# EasyEDA Pro project ProProject_hsr_pass_lite_2024-01-15.epro, board PCB_hsr_pass_lite_v1p1
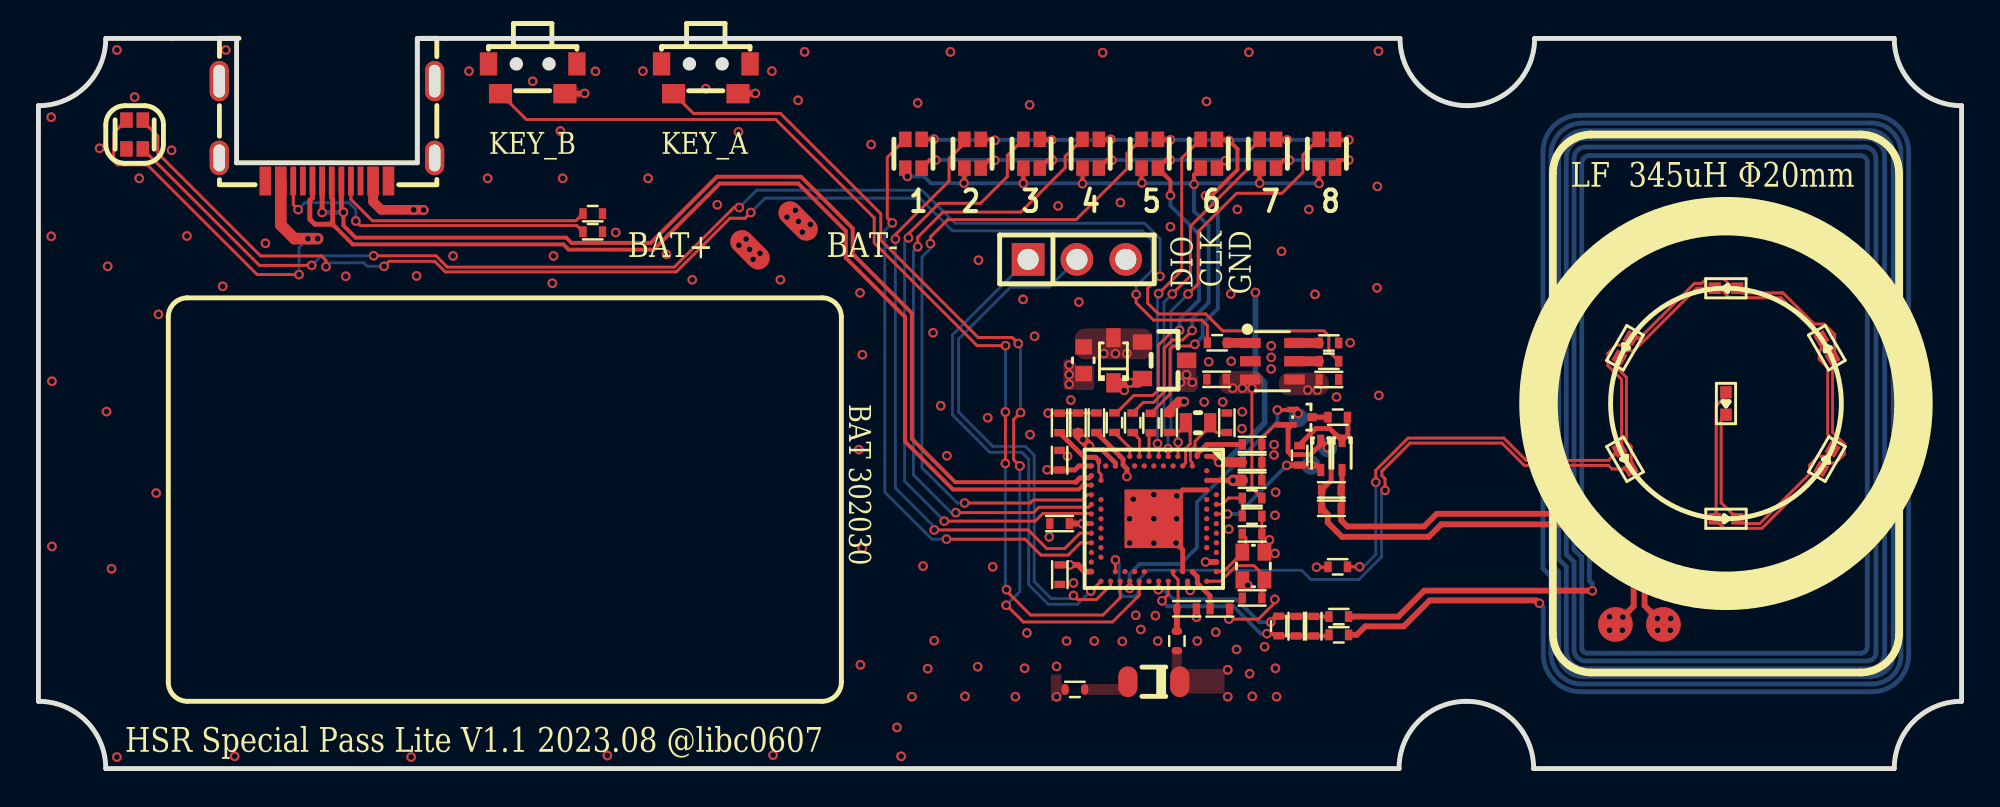
[diagram p1: board, top side]
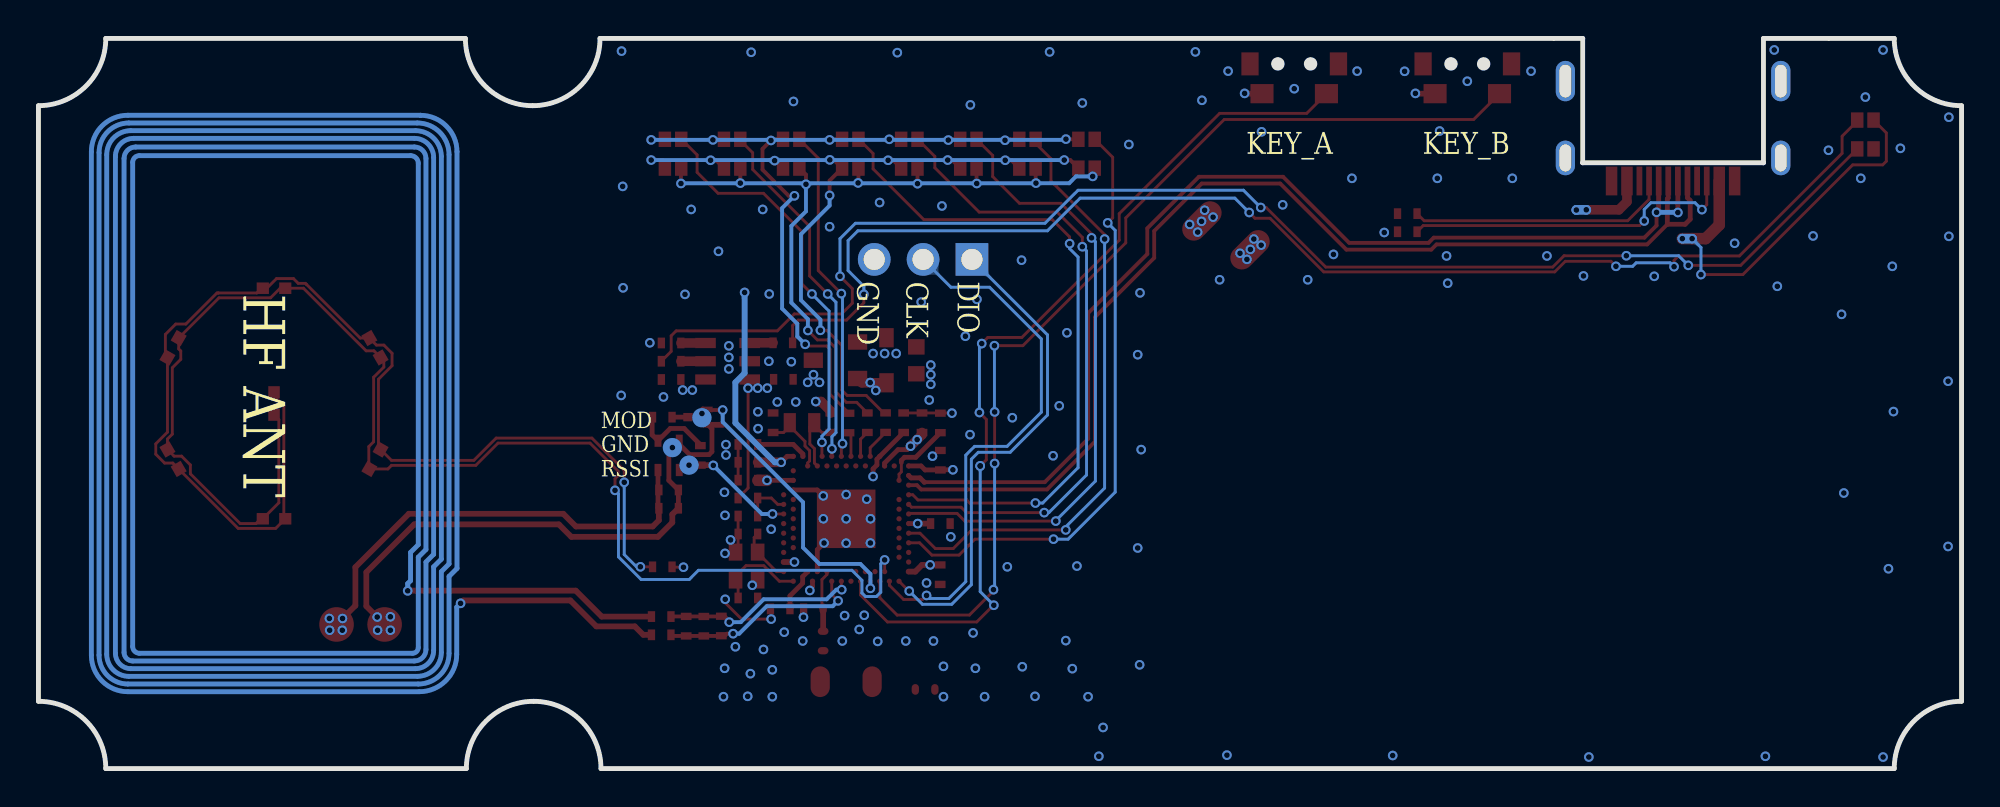
[diagram p2: board, bottom side, seen from below]

Outline 100 x 38 mm; copper layers: Top Layer, Inner1, Inner2, Bottom Layer. Coordinates in mm from the lower left corner of the outline.
Outline path: 0,3.5 0,34.5 arc(2.47,35.53) 3.5,38 10.3,38 10.3,31.53 19.7,31.53 19.7,38 70.8,38 arc(71.83,35.53) 74.3,34.5 arc(76.77,35.53) 77.8,38 96.5,38 arc(97.53,35.53) 100,34.5 100,3.5 arc(97.53,2.47) 96.5,0 77.75,0 arc(76.72,2.47) 74.25,3.5 arc(71.78,2.47) 70.75,0 3.5,0 arc(2.47,2.47) 0,3.5
Stack: Top Layer 0.035mm 外层铜厚1oz / Dielectric1 0.48mm 7628 RC49% 8.6mil / Inner1 0.035mm 内层铜厚 / Dielectric2 0.48mm 1.1mm H/HOZ 含铜 / Inner2 0.035mm 内层铜厚 / Dielectric3 0.48mm 7628 RC49% 8.6mil / Bottom Layer 0.035mm 外层铜厚1oz

## Design rules (mm)
net D-: DP1
net D+: DP1
template: 用户自定义配置
spacing Default (default): track to track 0.102, other pairs 0 to 0.102
track width Default (default): min 0.15, default 0.15, max 25.4
differential pair differentialPair (default): width min 0.127, default 0.254, max 2.54; gap min 0.152, default 0.152
via Default (default): diameter min 0.5, default 0.5, max 100.025; hole min 0.3, default 0.3, max 59.995
net GND uses copperRegion1
net VCC5V uses copperRegion1

## Placement (name value [footprint] x y rotation side)
ANT1  CA-C01  [ant-smd_l3.2-w1.6_ca-c01]  58 4.52 180 top
C1  1uF  [c0402]  63.11 15.01 180 top
C2  4.7uF  [c0402]  54.06 18 90 top
C5  100pF  [c0402]  65.4 7.41 90 top
C6  12pF  [c0402]  66.32 7.41 270 top
C8  100nF  [c0402]  63.11 16.87 0 top
C9  4.7uF  [c0402]  63.11 15.94 0 top
C11  12pF  [c0402]  63.11 12.21 0 top
C16  6pF  [c0402]  61.8 18 90 top
C17  12pF  [c0402]  63.11 8.88 180 top
C19  100nF  [c0402]  61.43 8.31 0 top
C20  6pF  [c0402]  58.8 18 90 top
C21  0.8pF  [c0402#2]  59.7 8.32 180 top
C25  4.7uF  [c0402]  55.01 18 90 top
C26  4.7uF  [c0402]  53.1 17.99 90 top
C27  100nF  [c0402]  53.11 10.09 270 top
C31  4.7uF  [c0402]  53.1 16.05 90 top
C33  1nF  [c0402]  67.23 13.55 0 top
C34  3.3nF  [c0402]  67.23 14.5 0 top
C39  100nF  [c0402]  53.1 12.75 180 top
C49  1uF  [c0402]  61.26 20.26 0 top
C50  4.7uF  [c0402]  67.1 20.25 0 top
D1  1N5819WS  [SOD-323_L1.8-W1.3-LS2.5-RD]  55.9 21.25 90 top
H1  PZ254V-11-03P  [HDR-TH_3P-P2.54-V-M]  54 26.5 0 top
IC6  nRF52840-QIAA  [aqfn50p700x700x85_hs-74n]  58 13 270 top
L5  3.9nH  [l0402]  59.2 6.64 270 top
L6  300R@100M  [l0603]  54.35 21.25 90 top
LED9  NCD0402W1  [LED0402-R-RD]  87.75 25 0 top
LED19  XL-1615RGBC-RF  [LED-ARRAY-SMD_4P-L1.6-W1.5-BR_XL-1615RGBC-RF]  5 33 90 top
LED20  XL-1615RGBC-RF  [LED-ARRAY-SMD_4P-L1.6-W1.5-BR_XL-1615RGBC-RF]  45.5 32 90 top
LED21  XL-1615RGBC-RF  [LED-ARRAY-SMD_4P-L1.6-W1.5-BR_XL-1615RGBC-RF]  48.57 32 90 top
LED22  XL-1615RGBC-RF  [LED-ARRAY-SMD_4P-L1.6-W1.5-BR_XL-1615RGBC-RF]  51.64 32 90 top
LED23  XL-1615RGBC-RF  [LED-ARRAY-SMD_4P-L1.6-W1.5-BR_XL-1615RGBC-RF]  54.71 32 90 top
LED24  XL-1615RGBC-RF  [LED-ARRAY-SMD_4P-L1.6-W1.5-BR_XL-1615RGBC-RF]  57.79 32 90 top
LED25  XL-1615RGBC-RF  [LED-ARRAY-SMD_4P-L1.6-W1.5-BR_XL-1615RGBC-RF]  60.86 32 90 top
LED26  XL-1615RGBC-RF  [LED-ARRAY-SMD_4P-L1.6-W1.5-BR_XL-1615RGBC-RF]  63.93 32 90 top
LED27  XL-1615RGBC-RF  [LED-ARRAY-SMD_4P-L1.6-W1.5-BR_XL-1615RGBC-RF]  67 32 90 top
LED28  NCD0402W1  [LED0402-R-RD]  87.75 13 180 top
LED29  NCD0402W1  [LED0402-R-RD]  93 16.1 240 top
LED30  NCD0402W1  [LED0402-R-RD]  93 21.9 300 top
LED31  NCD0402W1  [LED0402-R-RD]  82.5 21.9 60 top
LED32  NCD0402W1  [LED0402-R-RD]  82.5 16.1 120 top
LED33  NCD0402W1  [LED0402-R-RD]  87.75 19 90 top
NOREF  -  [Pad_e228]  84.5 7.5 180 top
NOREF#2  -  [Pad_e135]  67.04 16.7 0 top
NOREF#3  -  [Pad_e239]  82 7.5 180 top
NOREF#4  -  [Pad_e785]  39.5 28.5 135 top
NOREF#5  -  [Pad_e98]  65.5 18.26 0 top
NOREF#6  -  [Pad_e787]  37 27 135 top
NOREF#7  -  [Pad_e82]  66.17 15.79 0 top
Q3  -  [SOT-723_L1.2-W0.8-P0.40-LS1.2-BR]  65.69 18.29 180 top
Q5  AO3401A  [SOT-23_L2.9-W1.3-P1.90-LS2.4-BR]  58.56 21.25 180 top
R4  0Ω  [R0402]  67.62 7.91 180 top
R8  0Ω  [R0402]  67.62 6.96 180 top
R11  220Ω  [r0402]  67.56 18.29 0 top
R12  470kΩ  [r0402]  65.58 16.3 90 top
R19  1kΩ  [r0402]  57.85 17.98 270 top
R20  2kΩ  [r0402]  55.95 18 270 top
R21  1kΩ  [r0402]  56.9 18 270 top
R22  5.1kΩ  [r0402]  28.82 28.88 0 top
R23  5.1kΩ  [r0402]  28.82 27.94 0 top
R24  1kΩ  [r0402]  67.56 10.5 180 top
R25  2MΩ  [r0402]  63.11 14.08 0 top
R27  2MΩ  [r0402]  63.11 13.14 180 top
R28  NC  [R0402]  64.49 7.42 90 top
R29  5.1kΩ  [r0402]  67.1 22.15 180 top
R30  1kΩ  [r0402]  67.1 21.2 0 top
R31  1kΩ  [r0402]  61.29 22.16 0 top
R32  0  [r0402#2]  53.9 4.12 180 top
SW1  TS24CA  [SW-SMD_TS24CA]  25.7 35.9 0 top
SW2  TS24CA  [SW-SMD_TS24CA]  34.7 35.9 0 top
U4  TP4057-42-SOT26-R  [SOT-23-6_L2.9-W1.6-P0.95-LS2.8-BL]  64.16 21.2 270 top
USB1  TYPE-C 16P CB1.6  [USB-C-SMD_TYPE-C-16P-CB0.8-FIX]  15 33.18 180 top
VD1  -  [SOD-523_L1.2-W0.8-LS1.6-RD]  67.78 16.3 270 top
VD2  -  [SOD-523_L1.2-W0.8-LS1.6-RD]  66.68 16.3 270 top
X1  32MHz  [bt-xtal_2016]  63.18 10.54 90 top
X2  32.768kHz  [CRYSTAL-SMD_L1.7-W1.1]  60.3 18 0 top

## Footprints (pads in the part's own frame, mm; a bottom-side part is the same pattern mirrored in y, then rotated)
ant-smd_l3.2-w1.6_ca-c01
  rrect 1x1.6 smd: 1(-1.35,0) 2(1.35,0)
aqfn50p700x700x85_hs-74n
  rect 3.048x3.048 smd: 74(0,0)
  round 0.275 smd: A8(-1.25,3.25) A10(-0.75,3.25) A12(-0.25,3.25) A14(0.25,3.25) A16(0.75,3.25) A18(1.25,3.25) A20(1.75,3.25) A22(2.25,3.25) A23(2.75,3.25) AA24(3.25,-2.25) AB2(-2.75,-2.5) AC5(-2,-2.75) AC9(-1,-2.75) AC11(-0.5,-2.75) AC13(0,-2.75) AC15(0.5,-2.75) AC17(1,-2.75) AC19(1.5,-2.75) AC21(2,-2.75) AC24(3.25,-2.75) AD2(-2.75,-3.25) AD4(-2.25,-3.25) AD6(-1.75,-3.25) AD8(-1.25,-3.25) AD10(-0.75,-3.25) AD12(-0.25,-3.25) AD14(0.25,-3.25) AD16(0.75,-3.25) AD18(1.25,-3.25) AD20(1.75,-3.25) AD22(2.25,-3.25) AD23(2.75,-3.25) B1(-3.25,2.75) B3(-2.5,2.75) B5(-2,2.75) B7(-1.5,2.75) B9(-1,2.75) B11(-0.5,2.75) B13(0,2.75) B15(0.5,2.75) B17(1,2.75) B19(1.5,2.75) B24(3.25,2.75) C1(-3.25,2.25) D2(-2.75,2) D23(2.75,2) E24(3.25,1.75) F2(-2.75,1.5) F23(2.75,1.5) G1(-3.25,1.25) H2(-2.75,1) H23(2.75,1) J1(-3.25,0.75) J24(3.25,0.75) K2(-2.75,0.5) L1(-3.25,0.25) L24(3.25,0.25) M2(-2.75,0) N1(-3.25,-0.25) N24(3.25,-0.25) P2(-2.75,-0.5) P23(2.75,-0.5) R1(-3.25,-0.75) R24(3.25,-0.75) T2(-2.75,-1) T23(2.75,-1) U1(-3.25,-1.25) U24(3.25,-1.25) V23(2.75,-1.5) W1(-3.25,-1.75) W24(3.25,-1.75) Y2(-2.75,-2) Y23(2.75,-2)
bt-xtal_2016
  rect 0.889x0.711 smd: 1(-0.725,-0.575) 2(0.725,-0.575) 3(0.725,0.575) 4(-0.725,0.575)
c0402
  rect 0.381x0.559 smd: 1(-0.509,0) 2(0.507,0)
c0402#2
  rect 0.381x0.559 smd: 1(-0.509,0)
  rrect 0.381x0.559 smd: 2(0.507,0)
CRYSTAL-SMD_L1.7-W1.1
  rect 0.635x1 smd: 1(-0.635,0) 2(0.635,0)
HDR-TH_3P-P2.54-V-M
  rect 1.7x1.7 hole 1.1: 1(-2.54,0)
  round 1.7 hole 1.1: 2(0,0) 3(2.54,0)
l0402
  rrect 0.381x0.559 smd: 1(-0.509,0) 2(0.507,0)
l0603
  rect 0.8x0.864 smd: 1(-0.7,0) 2(0.7,0)
LED0402-R-RD
  rect 0.635x0.6 smd: 1(0.584,0) 2(-0.584,0)
LED-ARRAY-SMD_4P-L1.6-W1.5-BR_XL-1615RGBC-RF
  rect 0.8x0.65 smd: 1(0.75,-0.425) 2(0.75,0.425) 3(-0.75,0.425) 4(-0.75,-0.425)
Pad_e82
  round 1 smd far side: 8(0,0)
Pad_e98
  round 1 smd far side: 9(0,0)
Pad_e135
  round 1 smd far side: 10(0,0)
Pad_e228
  round 1.8 smd: 0(0,0)
Pad_e239
  round 1.8 smd: 0(0,0)
Pad_e785
  oval 2.4x1.2 smd: 7(0,0)
Pad_e787
  oval 2.4x1.2 smd: 7(0,0)
r0402
  rect 0.381x0.559 smd: 1(-0.508,0) 2(0.508,0)
r0402#2
  rrect 0.381x0.559 smd: 1(-0.508,0) 2(0.508,0)
R0402
  rect 0.381x0.559 smd: 1(-0.508,0) 2(0.508,0)
SOD-323_L1.8-W1.3-LS2.5-RD
  rect 1x0.75 smd: 1(-1.173,0) 2(1.173,0)
SOD-523_L1.2-W0.8-LS1.6-RD
  rect 0.635x0.36 smd: 1(-0.762,0) 2(0.762,0)
SOT-23-6_L2.9-W1.6-P0.95-LS2.8-BL
  rect 0.532x1.072 smd: 1(-0.95,-1.149) 2(0,-1.149) 3(0.95,-1.149) 4(0.95,1.149) 5(0,1.149) 6(-0.95,1.149)
SOT-23_L2.9-W1.3-P1.90-LS2.4-BR
  rect 1x0.8 smd: 1(1.15,-0.95) 2(1.15,0.95) 3(-1.15,0)
SOT-723_L1.2-W0.8-P0.40-LS1.2-BR
  rect 0.489x0.294 smd: 1(0.508,-0.4) 2(0.508,0.4)
  rect 0.489x0.434 smd: 3(-0.529,0)
SW-SMD_TS24CA
  rect 0.9x1.2 smd: 1(-2.3,0.775) 2(2.3,0.775)
  rect 1.2x1 smd: 3(-1.675,-0.775) 4(1.675,-0.775)
USB-C-SMD_TYPE-C-16P-CB0.8-FIX
  oval 1x1.8 hole 0.6x1.4: 0(-5.6,1.4) 2(5.6,1.4)
  oval 1x2.1 hole 0.6x1.7: 1(-5.6,-2.6) 3(5.6,-2.6)
  rect 0.6x1.5 smd: A1B12(-3.2,2.6) A4B9(-2.4,2.6) B1A12(3.2,2.6) B4A9(2.4,2.6)
  rect 0.3x1.5 smd: A5(-1.25,2.6) A6(-0.25,2.6) A7(0.25,2.6) A8(1.25,2.6) B5(1.75,2.6) B6(0.75,2.6) B7(-0.75,2.6) B8(-1.75,2.6)

## Nets
As in the schematic, except:
GND: ANT1.1 C1.1 C2.2 C8.2 C9.2 C11.2 C16.2 C17.2 C19.2 C20.2 C21.1 C25.2 C26.2 C27.2 C31.2 C33.1 C34.1 C39.2 C49.1 C50.2 H1.3 IC6.74 IC6.B7 IC6.F23 L5.2 NOREF#2.10 NOREF#3.0 NOREF#4.7 Q3.2 R22.2 R23.2 R27.1 R29.1 R32.2 SW1.1 SW1.2 SW2.1 SW2.2 U4.2 USB1.0 USB1.1 USB1.2 USB1.3 USB1.A1B12 USB1.B1A12 VD2.1 X1.2 X1.4
BAT: C49.2 NOREF#6.7 Q5.3 R25.2 U4.3
LF_MOD: IC6.U24 NOREF#5.9 Q3.1
LF_RSSI: IC6.A12 NOREF#7.8 R12.1 VD2.2
P_LF_ANT_RAW: C33.2 C34.2 NOREF.0 VD1.2

Pads without a net: IC6 A18 AB2 B3 N24; LED19 3; USB1 A8 B8

## Via types
v1: diameter 0.5, hole 0.3, Top Layer to Bottom Layer, 280 vias
v2: diameter 0.5, hole 0.299, Top Layer to Bottom Layer, 5 vias

## Routing (per net, layer and track width the routed paths; a pad name or vN(x,y) marks a point on that pad's centre or on a via; arc(x,y) is an arc through that point)
GND: length 48.4
  Top Layer w0.15: v1(64.29,8.81) 64.29,8.63 63.44,7.78 v1(61.9,7.78) ; C25.2 C2.2 52.51,18.51 v1(52.5,18.5) ; R27.1 C11.2 63.62,11.4 X1.2 ; C1.1 C9.2 63.62,17.12 63.58,17.16 64.31,17.89 64.4,17.89
  Top Layer w0.25: C33.1 C34.1 67.22,15 67.22,16.52 v1(67.04,16.7) VD2.1 66.68,16.88 66.14,16.34 65.13,16.34 64.98,16.49 64.98,17.68 Q3.2 ; IC6.B7 59.5,14.5 v1(59.19,14.19) v1(58,13) 58,12.89 v1(59.15,11.74) 59.5,11.39 IC6.F23
  Top Layer w0.3: C33.1 67.04,13.23 67.04,12.81 67.79,12.06 72.29,12.06 72.94,12.71 80.46,12.71 82.95,10.22 82.95,8.45 v1(82.39,7.89) NOREF#3.0 ; Q3.2 64.4,17.89
  Top Layer w0.5: v1(59.58,19.1) 59.3,19.1 58.8,18.6 C20.2
  vias: v1(0.66,33.9) v1(0.66,27.7) v1(0.7,20.16) v1(0.7,11.56) v1(3.18,32.28) v1(3.54,18.58) v1(3.6,26.14) v1(3.8,10.4) v1(4.08,37.4) v1(4.08,0.6) v1(5,34.95) v1(5.24,30.72) v1(6.12,14.34) v1(6.24,23.64) v1(6.92,32.18) v1(7.72,27.72) v1(9.58,25.1) v1(9.74,37.4) v1(10.2,0.64) v1(11.8,27.34) v1(15.98,25.62) v1(19.38,0.6) v1(19.66,25.64) v1(21.56,26.68) v1(22.39,36.3) v1(23.36,30.72) v1(25.7,35.77) v1(26.72,25.26) v1(26.78,26.68) v1(27.14,33.18) v1(27.26,30.72) v1(28.96,36.29) v1(29.58,0.68) v1(30.02,27.9) v1(31.43,36.3) v1(31.7,30.72) v1(32.66,26.76) v1(34,25.44) v1(34.7,35.38) v1(35.3,29.34) v1(36.4,33.14) v1(38.14,36.3) v1(38.2,0.7) v1(38.58,25.44) v1(38.92,28.7) v1(39.36,29.06) v1(39.5,34.78) v1(39.52,28.48) v1(39.72,27.92) v1(39.84,37.3) v1(40.14,28.32) v1(42.72,24.76) v1(42.66,16.6) v1(42.74,5.4) v1(42.84,21.54) v1(42.84,11.48) v1(43.3,32.48) v1(44.64,2.14) v1(44.86,0.64) v1(45.42,3.74) v1(45.72,34.64) v1(46,10.54) v1(46.24,5.2) v1(46.52,22.68) v1(46.58,6.66) v1(46.92,18.88) v1(47.24,16.28) v1(47.42,37.3) v1(48.18,3.76) v1(48.84,5.3) v1(48.88,26.46) v1(49.36,18.26) v1(49.62,10.5) v1(50.8,3.74) v1(51.2,24.42) v1(51.28,5.22) v1(51.4,7.06) v1(51.54,34.54) v1(51.56,17.38) v1(51.8,22.5) v1(52.56,12.06) v1(52.94,5.32) v1(52.94,3.74) v1(53.02,29.28) v1(53.51,16.26) v1(53.46,6.64) v1(53.68,19.18) v1(53.82,9.66) v1(54.1,24.28) v1(54.9,6.64) v1(55.34,37.26) v1(56.26,29.46) v1(56.36,6.62) v1(56.74,13) v1(56.74,11.74) v1(56.93,14.02) v1(57.06,7.98) v1(57.32,7.24) v1(58,14.26) v1(58,11.73) v1(58.08,7.96) v1(58.2,6.64) v1(58.86,28.2) v1(59.19,13) v1(60.22,7.88) v1(60.26,6.64) v1(60.62,19.08) v1(60.74,34.72) v1(60.85,21.17) v1(61.22,7.1) v1(61.58,19.08) v1(61.84,5.14) v1(61.84,3.74) v1(61.9,12.46) v1(62,24.7) v1(62.02,21.2) v1(62.34,29.1) v1(62.3,6.2) v1(62.59,18.57) v1(62.58,17.69) v1(62.94,37.28) v1(62.88,9.54) v1(62.98,4.94) v1(63.12,3.76) v1(63.76,6.34) v1(64.01,11.9) v1(64.1,22) v1(64.1,21.4) v1(64.1,20.8) v1(64.25,16.86) v1(64.25,16.32) v1(64.33,14.38) v1(64.3,13.18) v1(64.3,11.2) v1(64.32,5.22) v1(64.38,3.74) v1(64.64,26.92) v1(66.06,29.1) v1(66.38,24.68) v1(67.5,19.34) v1(68.21,22.16) v1(69.62,30.3) v1(69.6,25.02) v1(69.68,37.34) v1(69.7,19.42) v1(81.7,7.9) v1(81.7,7.2) v1(82.37,7.2)
GNDHF: length 552.3
  Top Layer w0.3: v1(78.05,8.6) 77.9,8.75 72.34,8.75 70.99,7.4 68.99,7.4 68.55,6.96 R8.1 ; R4.1 70.71,7.91 72.06,9.26 80.79,9.26 v1(80.8,9.25)
  Bottom Layer w0.25: v1(78.05,8.6) 78.25,8.4 78.25,5.95 arc(78.82,4.57) 80.2,4 95.35,4 arc(96.69,4.56) 97.25,5.9 97.25,32.1 ; v1(80.8,9.25) 80.8,9.63 80.65,9.78 80.65,11.25 80.25,11.65 80.25,31.5 arc(80.37,31.78) 80.65,31.9 94.75,31.9 arc(95,31.8) 95.1,31.55 95.1,6.35 arc(95,6.1) 94.75,6 80.55,6 arc(80.34,6.09) 80.25,6.3 80.25,11 79.85,11.4 79.85,31.75 arc(80.03,32.17) 80.45,32.35 94.95,32.35 arc(95.37,32.17) 95.55,31.75 95.55,6.05 arc(95.42,5.73) 95.1,5.6 80.45,5.6 arc(80.03,5.78) 79.85,6.2 79.85,10.75 79.45,11.15 79.45,31.8 arc(79.74,32.51) 80.45,32.8 95.05,32.8 arc(95.72,32.52) 96,31.85 96,6 arc(95.77,5.43) 95.2,5.2 80.4,5.2 arc(79.73,5.48) 79.45,6.15 79.45,10.5 79.05,10.9 79.05,31.85 arc(79.45,32.8) 80.4,33.2 95.2,33.2 arc(96.08,32.83) 96.45,31.95 96.45,5.95 arc(96.11,5.14) 95.3,4.8 80.3,4.8 arc(79.42,5.17) 79.05,6.05 79.05,10.25 78.65,10.65 78.65,31.95 arc(79.13,33.12) 80.3,33.6 95.3,33.6 arc(96.4,33.15) 96.85,32.05 96.85,5.9 arc(96.41,4.84) 95.35,4.4 80.25,4.4 arc(79.12,4.87) 78.65,6 78.65,10 78.24,10.41 78.24,32.1 arc(78.79,33.44) 80.14,34 80.14,34 95.35,34 arc(96.7,33.44) 97.25,32.1
VCC3.3V: length 89.8
  Top Layer w0.15: v1(66.46,10.48) 67.03,10.48 R24.2
  Top Layer w0.25: IC6.AD14 v1(54.28,12.75) ; IC6.B1 61.07,16.25 v1(61.38,15.94) ; C25.1 IC6.W1 56.4,16.1 56.4,15.8 56.6,15.6 v1(56.6,15.2)
  Top Layer w0.3: v1(37.28,35.14) 37.26,35.12 SW2.4 ; IC6.AD23 54.4,10.25 54.05,10.6 v1(53.63,10.6) C27.1 ; v1(60.69,10.75) IC6.A22 ; v1(28.4,35.14) 28.38,35.12 SW1.4 ; v1(54.28,12.75) C39.1
  Top Layer w0.5: v1(61.38,15.94) C9.1
  Inner2 w0.4: v1(61.38,15.94) 62.4,15.94 63.24,15.1 63.24,13.13 63.87,12.5 64.5,12.5 66.46,10.54 v1(66.46,10.48)
  Inner2 w0.6: v1(28.4,35.14) 29.26,34.28 36.42,34.28 v1(37.28,35.14) 38.7,33.72 62.2,33.72 62.62,33.3 62.62,29.98 63.28,29.32 v1(63.28,24.78)
  Inner2 w0.8: 59.96,15.2 59.96,11.48 v1(60.69,10.75) ; 59.96,15.2 56.9,15.2 54.45,12.75 v1(54.28,12.75) 53.63,12.1 v1(53.63,10.6) ; 59.96,15.2 60.64,15.2 v1(61.38,15.94)
  Bottom Layer w0.3: v1(61.38,15.94) 61.71,15.94 63.76,17.99 63.76,20.1 63.28,20.58 v1(63.28,24.78)
VCC5V: length 27
  Top Layer w0.25: v1(52.45,15.55) 53.09,15.55 C31.1 53.9,15.54 54.1,15.75 IC6.AD2
  Inner2 w0.4: v1(52.45,15.55) 52.45,16.95 55.99,20.49 55.99,21.01 v1(55.4,21.6)
  Inner2 w1: v1(66.5,19.7) v1(66,19.7) 66,22.8 65.1,23.7 56.8,23.7 56,22.9 v1(56,21.6) ; v1(56,21.6) v1(55.4,21.6) ; v1(56,21.6) v1(56.6,21.6)
BAT: length 43.8
  Top Layer w0.15: v1(63.1,19.8) 63.1,14.6 R25.2
  Inner2 w1: 36.66,27.34 v1(36.98,27.02) 37.3,26.7 43.22,26.7 45,24.92 45,22 48.2,18.8 48.2,16.59 50.29,14.5 54.51,14.5 55.9,15.89 55.9,17.3 58.7,20.1 v1(59.39,20.1) v1(60,20.1) 63.1,20.1
  vias: v1(36.42,27.24) v1(36.8,27.56) v1(37.16,26.5) v1(37.52,26.82) v1(59.7,20.5) v1(62.1,19.8) v1(62.6,19.8)
CC1: length 13.6
  Top Layer w0.15: USB1.A5 16.25,29.62 17.36,28.51 27.94,28.51 R22.1
CC2: length 17.5
  Top Layer w0.15: USB1.B5 13.25,29.34 v1(13.5,29.09) ; v1(16.5,28.5) 16.74,28.26 27.99,28.26 R23.1
  Bottom Layer w0.15: v1(16.5,28.5) 16.5,29.1 16.15,29.45 13.86,29.45 v1(13.5,29.09)
CHRG: length 1.2
  Top Layer w0.5: 63.01,22.15 63,22.16 R31.2
D+: length 58.3
  Top Layer w0.2: 15.3,28.33 16.34,27.28 27.3,27.28 27.57,27.01 31.99,27.01 35.43,30.45 39.51,30.45 41.98,27.98 41.98,26.58 45.06,23.5 45.06,17.02 47.55,14.53 54.1,14.53 54.32,14.75 IC6.AD6
  Top Layer w0.25: USB1.B6 14.25,29.7 14.11,29.56 14.11,28.59 14.37,28.33 15.3,28.33 15.3,29.66 15.25,29.7 USB1.A6
D-: length 57.1
  Top Layer w0.2: 53.92,14.91 47.67,14.91 45.41,17.17 45.41,23.71 42.34,26.78 42.34,28.12 39.66,30.8 35.28,30.8 31.84,27.36 27.72,27.36 27.45,27.63 16.49,27.63 15.86,28.26 v1(15.86,28.95)
  Top Layer w0.25: v1(14.75,28.94) USB1.A7
  Top Layer w0.254: 53.92,14.91 53.94,14.91 54.16,15.13 54.63,15.13 IC6.AD4 ; USB1.B7 15.75,29.06 v1(15.86,28.95)
  Bottom Layer w0.25: v1(15.86,28.95) 14.76,28.95 v1(14.75,28.94)
DEC1: length 2.7
  Top Layer w0.25: IC6.C1 60.25,16.37 60.75,16.87 C8.1
DEC3: length 2.3
  Top Layer w0.25: IC6.D23 60.26,9.99 60.26,9.65 60.92,8.99 60.92,8.31
DEC4_6: length 10
  Top Layer w0.25: v1(59.89,9.27) 59.89,9.35 59.75,9.49 IC6.E24 ; IC6.B5 v2(62.12,15)
  Top Layer w0.6: v2(62.12,15) 62.59,15
  Inner2 w0.6: v1(59.89,9.27) 60.57,9.27 61.6,10.3 61.6,11.4 60.9,12.1 60.9,13.78 v2(62.12,15)
KEY_A: length 47
  Top Layer w0.15: SW2.3 34.05,34.1 38.58,34.1 43.8,28.88 43.8,27.5 48.86,22.44 50.63,22.44 v1(50.95,22.12) ; v1(51.03,15.75) 50.71,16.07 50.71,18.17 v1(51.07,18.53) ; v1(50.32,8.5) 50.49,8.33 50.51,8.33 51.21,7.63 55.85,7.63 57.25,9.03 IC6.R24
  Bottom Layer w0.15: v1(51.07,18.53) 51.07,22 v1(50.95,22.12) ; v1(50.32,8.5) 51.03,9.21 v1(51.03,15.75)
KEY_B: length 52.9
  Top Layer w0.15: IC6.W24 56.25,8.89 55.35,7.99 51.59,7.99 50.34,9.24 v1(50.34,9.31) ; v1(50.28,15.88) v1(50.28,18.56) ; v1(50.29,22.01) 48.81,22.01 43.46,27.36 43.46,28.66 38.34,33.78 25.37,33.78 SW1.3
  Bottom Layer w0.15: v1(50.28,18.56) 50.29,18.57 v1(50.29,22.01) ; v1(50.34,9.31) 50.28,9.37 v1(50.28,15.88)
LED1: length 31.4
  Top Layer w0.15: v1(47.22,11.94) 51.3,11.94 52.13,11.11 53.54,11.11 54.18,11.75 IC6.AD18 ; v1(44.4,28.4) 44.14,28.66 44.14,31.81 LED20.2
  Bottom Layer w0.15: v1(47.22,11.94) 46.46,11.94 44.01,14.39 44.01,28.01 v1(44.4,28.4)
LED2: length 31.6
  Top Layer w0.15: v1(44.56,27.56) 44.56,27.79 47.35,30.58 47.35,31.74 48.15,32.54 LED21.2 ; IC6.AD16 54.16,12.25 53.36,11.45 52.43,11.45 51.46,12.42 v1(46.58,12.42)
  Bottom Layer w0.15: v1(46.58,12.42) 46.58,12.58 44.56,14.6 v1(44.56,27.56)
LED3: length 32.4
  Top Layer w0.15: v1(45.24,27.62) 45.24,27.83 46.83,29.42 48.99,29.42 50.38,30.81 50.38,31.91 LED22.2 ; IC6.AD12 54.72,13.28 52.23,13.28 51.83,12.88 v1(47.1,12.88)
  Bottom Layer w0.15: v1(45.24,27.62) 45.04,27.42 45.04,14.96 47.1,12.9 v1(47.1,12.88)
LED4: length 33.7
  Top Layer w0.15: IC6.AD10 54.6,13.6 52.02,13.6 51.74,13.32 v1(47.7,13.32) ; LED23.2 54.28,32.75 53.39,31.86 53.39,31.27 51.08,28.96 47.03,28.96 45.72,27.65 v1(45.72,27.16)
  Bottom Layer w0.15: v1(45.72,27.16) 45.5,26.94 45.5,15.28 47.46,13.32 v1(47.7,13.32)
LED5: length 35.5
  Top Layer w0.15: v1(46.38,27.32) 46.38,27.67 47.28,28.57 53.96,28.57 56.6,31.21 56.6,32.01 57.34,32.75 LED24.2 ; IC6.AD8 54.54,14.25 54.27,13.98 51.73,13.98 51.57,13.82 v1(48.16,13.82)
  Bottom Layer w0.15: v1(46.38,27.32) 46.38,27.06 45.94,26.62 45.94,15.66 47.78,13.82 v1(48.16,13.82)
LED6: length 17.5
  Top Layer w0.15: v1(58.25,24.72) 59.45,25.92 59.45,31.77 LED25.2 ; IC6.L1 58.25,16.85 v1(58.19,16.91)
  Bottom Layer w0.15: v1(58.25,24.72) 58.19,24.66 v1(58.19,16.91)
LED7: length 18.7
  Top Layer w0.15: v1(58.74,16.64) 58.74,16.26 IC6.J1 ; LED26.2 63.5,32.69 62.86,32.05 62.86,31.18 59.9,28.22 59.9,25.64 v1(58.96,24.7)
  Bottom Layer w0.15: v1(58.96,24.7) 58.53,24.27 58.53,17.48 58.74,17.27 v1(58.74,16.64)
LED8: length 21.2
  Top Layer w0.15: IC6.G1 59.26,16.26 v1(59.26,16.98) ; v1(59.78,24.7) 60.3,25.22 60.3,27.94 62.3,29.94 64.66,29.94 65.75,31.03 65.75,31.94 66.56,32.75 LED27.2
  Bottom Layer w0.15: v1(59.26,16.98) 59.26,17.3 58.89,17.67 58.89,23.81 v1(59.78,24.7)
LED_B_H: length 1.4
  Top Layer w0.15: IC6.R1 57.25,17.14 R21.2
LED_G_H: length 1.6
  Top Layer w0.15: IC6.U1 56.75,16.7 R20.2
LED_R_H: length 1.3
  Top Layer w0.15: IC6.N1 57.75,17.38 R19.2
LEDFIELD: length 74.6
  Top Layer w0.15: LED33.2 87.5,18.17 87.5,13.83 LED28.2 88.44,13 88.69,12.75 89.51,12.75 92.1,15.34 92.1,15.8 92.56,16.26 92.95,16.26 LED29.2 93.29,17.15 93.04,17.4 93.04,20.86 92.6,21.3 92.6,21.73 92.71,21.84 LED30.2 90.61,24.5 87.93,24.5 87.43,25 LED9.2 86.22,25 82.96,21.74 82.55,21.74 LED31.2 82.04,21.23 82.04,20.9 82.57,20.36 82.57,17.01 82.82,16.76 82.82,15.62 LED32.2 81.83,15.59 81.64,15.78 77.26,15.78 76.1,16.94 71.32,16.94 69.86,15.48 69.86,15.24 70.02,15.08 v1(70.02,14.48) ; v1(56,10.86) IC6.Y23
  Bottom Layer w0.15: v1(56,10.86) 56.2,10.66 56.2,9.18 56.43,8.95 56.99,8.95 57.18,9.14 57.18,9.8 57.7,10.32 65.68,10.32 66.16,9.84 68.66,9.84 69.84,11.02 69.84,14.3 v1(70.02,14.48)
LF_MOD: length 15.4
  Top Layer w0.15: IC6.U24 56.75,9.39 v1(56.74,9.38)
  Top Layer w0.2: v1(65.5,18.48) 65.5,18.7 65.46,18.74 65.41,18.69 Q3.1 65.16,18.66 v2(64.42,18.66)
  Bottom Layer w0.2: v2(64.42,18.66) 64.42,18.04 60.24,13.86 60.24,11.5 59.39,10.65 57.26,10.65 56.74,10.13 v1(56.74,9.38)
LF_OA: length 4
  Top Layer w0.25: R12.2 65.58,16.86 66.42,17.7 67.15,17.7 VD1.1 68.09,17.37 68.09,18.1
LF_RSSI: length 6.6
  Top Layer w0.15: IC6.A12 v1(61.83,13.25)
  Top Layer w0.25: VD2.2 66.43,15.79 v1(66.17,15.79) R12.1
  Top Layer w0.3: v2(64.91,15.78) 64.92,15.79 R12.1
  Bottom Layer w0.2: v2(64.91,15.78) 62.38,13.25 v1(61.83,13.25)
MIXVIN: length 8.6
  Top Layer w0.25: v1(54.65,16.78) 54.83,16.6 55.3,16.6 56,15.9 IC6.Y2
  Top Layer w0.5: D1.1 56.69,20.08 ; Q5.2 57.19,20.08 56.74,20.08 ; C2.1 54.06,17.38 v1(54.31,17.12) v1(54.65,16.78)
  Inner2 w1: v1(56.75,20.09) 56.75,19.97 v1(56.46,19.68) 54.65,17.87 v1(54.65,16.78)
NFC_NRF_A: length 10.6
  Top Layer w0.15: v1(58.42,8.73) 58.75,9.06 IC6.J24
  Top Layer w0.2: v2(63.88,7.02) 64.19,7.02 64.31,6.9 67.05,6.9 R8.2
  Bottom Layer w0.2: v2(63.88,7.02) 63.56,7.02 62.13,8.45 58.7,8.45 v1(58.42,8.73)
NFC_NRF_B: length 10.2
  Top Layer w0.15: IC6.L24 58.25,9.33 v1(58.23,9.31)
  Top Layer w0.2: v2(64.08,7.62) 64.08,7.69 64.31,7.92 67.1,7.92 R4.2
  Bottom Layer w0.2: v2(64.08,7.62) 63.48,7.62 62.29,8.81 59.01,8.81 58.51,9.31 v1(58.23,9.31)
P0.00/XL1: length 3.7
  Top Layer w0.15: 60.93,17.82 60.14,17.03 60.14,16.79 59.9,16.55 59.9,16.01 60,15.91 IC6.D2 ; 60.93,17.82 60.93,17.81 61.25,17.49 C16.1 ; 60.93,17.82 X2.2
P0.01/XL2: length 3.6
  Top Layer w0.15: IC6.F2 59.65,15.9 59.65,16.65 59.89,16.89 59.89,17.77 X2.1 59.66,17.89 59.26,17.49 C20.1
P0.29/AIN5: length 2.4
  Top Layer w0.15: R27.2 R25.1 61.89,14.08 61.56,13.75 IC6.A10
P_LF_ANT_RAW: length 23.4
  Top Layer w0.25: C33.2 67.78,13.59 VD1.2
  Top Layer w0.3: C33.2 67.74,12.92 68.06,12.6 72.05,12.6 72.71,13.26 80.74,13.26 83.52,10.48 83.52,8.48 v1(84.19,7.81) NOREF.0
  vias: v1(84.2,7.2) v1(84.87,7.81) v1(84.86,7.2)
STDBY: length 1.3
  Top Layer w0.5: 66.59,21.2 U4.5
SWDCLK: length 28.1
  Top Layer w0.15: v1(53.82,9.01) 54.03,8.8 55.01,8.8 55.75,9.54 IC6.AA24
  Bottom Layer w0.15: v1(53.82,9.01) 53.66,8.85 52.66,8.85 51.78,9.73 51.78,16.31 51.32,16.77 49.63,16.77 47.85,18.55 47.85,22.36 50.54,25.05 52.55,25.05 H1.2
SWDIO: length 25.9
  Top Layer w0.15: IC6.AC24 54.74,9.24 v1(54.72,9.24)
  Bottom Layer w0.15: H1.1 47.53,22.57 47.53,18.4 49.47,16.46 51.13,16.46 51.49,16.1 51.49,9.57 52.51,8.55 54.03,8.55 v1(54.72,9.24)
VUSB: length 74.4
  Top Layer w0.15: LED19.2 3.91,33.08 3.91,31.61 4.1,31.42 5.66,31.42 11.37,25.71 v1(13.55,25.71)
  Top Layer w0.5: USB1.A4B9 17.4,29.5 17.82,29.08 v1(19.51,29.08) 20.02,29.08 v1(20.03,29.07)
  Top Layer w0.6: USB1.B4A9 12.6,28.29 13.31,27.58 v1(14.01,27.58) v1(14.52,27.58)
  Inner2 w1: v1(19.51,29.08) 19.51,28.71 18.38,27.58 v1(14.52,27.58)
  Inner2 w1.5: 35.56,31.64 41.66,31.64 43.64,29.66 45.76,29.66 47.5,27.92 47.5,26.46 ; 47.58,26.2 48.17,25.62 48.17,21.97 49.67,20.47 54.3,20.47 ; 35.44,31.52 32.99,29.07 v1(20.03,29.07)
  Bottom Layer w0.15: v1(13.55,25.71) 13.55,27.12 v1(14.01,27.58)
  Bottom Layer w0.5: v1(20.03,29.07) 20.02,29.08 v1(19.51,29.08) ; v1(14.52,27.58) v1(14.01,27.58)
  vias: v1(53.6,21) v1(53.6,20.5) v1(53.6,20)
XC1: length 4.9
  Top Layer w0.15: C17.1 63.62,9.52 63.93,9.83 63.21,10.56 62.28,10.56 61.47,9.75 IC6.B24
XC2: length 2.5
  Top Layer w0.15: 62.51,10.93 62.3,10.93 61.62,10.25 IC6.A23 ; 62.78,11.28 62.78,12.03 C11.1
$1N8545: length 0.8
  Top Layer w0.25: Q3.3 R11.1
$1N17137: length 3.7
  Top Layer w0.15: IC6.AC5 55.25,15.32 55.13,15.44 55.13,15.93
  Top Layer w0.25: C26.1 54.38,16.2 54.97,16.2 55.13,16.04 55.13,15.93
$1N17146: length 3.2
  Top Layer w0.15: C21.2 59.26,8.38 59.26,9.83 59,10.09 IC6.H23
  Top Layer w0.3: L5.1 C21.2
$1N18003: length 68
  Top Layer w0.15: LED19.1 5.42,33.69 6.21,32.91 6.21,32.02 11.55,26.68 14.72,26.68 14.95,26.44 v1(14.95,26.12) ; v1(37.04,28.94) 36.74,28.64 35.96,28.64 33.16,25.85 21.16,25.85 20.6,26.4 18.23,26.4 v1(17.97,26.14) ; R31.1 60.78,23.06 60.5,23.34 57.98,23.34 57.08,24.24 v1(57.08,24.68)
  Bottom Layer w0.15: v1(37.04,28.94) 37.79,29.69 45.83,29.69 47.53,27.99 57.39,27.99 57.9,27.48 57.9,25.92 57.08,25.1 v1(57.08,24.68) ; v1(14.95,26.12) 15.15,26.32 16.92,26.32 17.1,26.14 v1(17.97,26.14)
$1N18006: length 73.8
  Top Layer w0.15: v1(14.21,26.19) 11.48,26.19 LED19.4 ; v1(17.43,26.69) 20.67,26.69 21.26,26.1 33.06,26.1 36.16,29.2 v1(36.44,29.2) ; v1(58.32,25.62) 57.68,24.98 57.68,24.22 58.24,23.66 60.7,23.66 61.58,22.78 66.84,22.78 67.1,22.52 67.1,21.71 R30.2
  Bottom Layer w0.15: v1(58.32,25.62) 58.32,27.58 57.52,28.38 47.66,28.38 45.94,30.1 37.34,30.1 v1(36.44,29.2) ; v1(14.21,26.19) 14.71,26.69 v1(17.43,26.69)
$1N18050: length 1.3
  Top Layer w0.5: U4.6 66.59,22.15
$1N18926: length 44.6
  Top Layer w0.15: v1(60.13,22.08) 60.04,21.99 59.01,21.99 58.84,21.82 58.84,19.48 R19.1
  Top Layer w0.2: LED21.1 49.69,32.75 v1(49.74,32.7) ; LED24.1 58.83,32.75 v1(58.86,32.72) ; LED20.1 46.56,32.75 v1(46.57,32.76) ; LED27.1 67.46,32.72 v1(68.14,32.72) ; LED22.1 52.65,32.75 v1(52.69,32.71) ; LED25.1 61.85,32.75 v1(61.91,32.69) 62.35,32.25 62.35,31.17 60.99,29.81 v1(60.69,29.81) ; v1(64.93,32.72) 64.9,32.75 LED26.1 ; LED23.1 v1(55.76,32.75)
  Bottom Layer w0.2: v1(61.91,32.69) 61.91,32.69 61.91,32.72 ; 55.78,32.72 v1(58.86,32.72) 61.91,32.72 ; 55.78,32.72 52.69,32.72 ; 55.78,32.72 55.76,32.74 v1(55.76,32.75) ; 52.69,32.72 52.69,32.71 v1(52.69,32.71) ; 52.69,32.72 49.74,32.72 ; 61.91,32.72 v1(64.93,32.72) v1(68.14,32.72) ; v1(60.13,22.08) 60.54,22.49 60.54,23.15 61.33,23.94 61.33,29.17 v1(60.69,29.81) ; v1(49.74,32.7) 49.74,32.72 49.74,32.72 ; 49.74,32.72 46.57,32.72 v1(46.57,32.76)
$1N19313: length 42.3
  Top Layer w0.15: v1(59.99,22.8) 59.5,22.31 58.97,22.31 58.54,21.88 58.54,19.61 57.99,19.06 57.45,19.06 R21.1
  Top Layer w0.2: v1(48.13,30.47) 48.15,30.49 LED21.3 ; v1(57.38,30.48) 57.36,30.5 LED24.3 ; LED26.3 v1(63.5,30.47) ; v1(66.59,30.45) 66.59,31.23 LED27.3 ; v1(60.09,30.41) 60.09,30.91 60.43,31.25 LED25.3 ; v1(45.18,30.82) 45.18,31.14 LED20.3 ; v1(51.21,30.45) 51.22,30.46 LED22.3 ; LED23.3 v1(54.29,30.44)
  Bottom Layer w0.2: 54.29,30.46 57.38,30.46 ; 54.29,30.46 54.29,30.44 v1(54.29,30.44) ; 54.29,30.46 48.13,30.46 48.13,30.46 ; 57.38,30.46 57.38,30.46 v1(57.38,30.48) ; 57.38,30.46 63.51,30.46 ; v1(51.21,30.45) 51.21,30.46 ; v1(59.99,22.8) 59.99,23.39 60.85,24.25 60.85,28.24 60.09,29 v1(60.09,30.41) ; v1(48.13,30.47) 48.13,30.46 ; 48.13,30.46 46.4,30.46 46.05,30.82 v1(45.18,30.82) ; v1(63.5,30.47) 63.51,30.46 ; 63.51,30.46 66.58,30.46 v1(66.59,30.45)
$1N19333: length 44.9
  Top Layer w0.15: v1(59.34,22.81) 59.01,22.81 58.23,22.03 58.23,19.7 57.95,19.42 56.96,19.42 56.05,18.51 R20.1
  Top Layer w0.2: LED25.4 61.67,31.64 v1(61.72,31.64) ; LED26.4 64.76,31.66 v1(65.05,31.66) ; v1(55.82,31.66) 55.55,31.66 LED23.4 ; v1(68.14,31.67) 67.58,31.67 67.43,31.52 LED27.4 ; v1(58.86,29.83) 58.86,30.6 LED24.4 58.64,31.68 v1(58.85,31.68) ; v1(49.73,31.66) 49.41,31.66 LED21.4 ; LED20.4 46.34,31.67 v1(46.66,31.67) ; LED22.4 52.49,31.67 v1(52.72,31.67)
  Bottom Layer w0.2: v1(61.72,31.64) 61.93,31.64 61.96,31.67 ; v1(58.85,31.68) 58.85,31.67 ; 55.82,31.67 v1(52.72,31.67) 49.73,31.67 ; 55.82,31.67 v1(55.82,31.66) ; 55.82,31.67 65.05,31.67 ; 65.05,31.67 65.05,31.67 v1(65.05,31.66) ; 65.05,31.67 v1(68.14,31.67) ; v1(59.34,22.81) 59.34,23.37 60.35,24.38 60.35,27.81 58.86,29.3 v1(58.86,29.83) ; v1(46.66,31.67) 49.73,31.67 49.73,31.67 v1(49.73,31.66)
$1N21424: length 62
  Top Layer w0.15: v1(69.54,14.9) 69.54,15.52 71.22,17.2 76.2,17.2 77.36,16.04 81.64,16.04 LED32.1 82.32,16.72 82.32,20.26 81.61,20.97 81.61,21.61 82.04,22.04 82.43,22.04 LED31.1 83.27,22.41 86.06,25.2 86.07,25.2 86.12,25.25 86.49,25.25 86.74,25.5 87.62,25.5 88.12,25 LED9.1 88.4,25 88.65,24.75 90.65,24.75 90.65,24.75 90.72,24.75 92.34,23.14 92.86,23.14 93.4,22.6 93.4,21.5 LED30.1 93.29,17.51 93.9,16.9 93.9,16.36 93.44,15.9 93.01,15.9 LED29.1 89.61,12.5 87.67,12.5 LED28.1 87.24,13.07 87.24,18.88 87.75,19.39 LED33.1 ; R24.1 v1(68.7,10.5)
  Bottom Layer w0.15: v1(68.7,10.5) 68.9,10.5 69.54,11.14 v1(69.54,14.9)

## Copper pours and planes (outline as drawn; the poured copper is in the pictures)
GND on Top Layer: 59.76,5.18 61.68,5.18 61.68,3.91 59.76,3.91
GND on Top Layer: 53.2,3.5 45.1,3.5 45.1,-0.78 44.9,-0.98 -2.9,-0.98 -4.8,0.92 -4.8,41.32 -1.4,44.72 67.4,44.72 70,42.12 70,19.12 64.61,19.12 64.61,3.52 61.59,3.52 61.59,6.41 60.02,6.41 60.02,8.72 59.7,9.04 58.8,9.04 58.42,8.66 58.42,6.42 53.2,6.42
GND on Bottom Layer: -3.5,42.9 69.2,42.9 70,42.1 70,19.1 64.61,19.1 64.61,3.5 61.6,3.5 61.6,6.4 53.2,6.4 53.2,3.5 45.1,3.5 45.1,-3 44.6,-3.5 -7,-3.5 -9.9,-0.6 -9.9,36.5
GND on Inner1: 53.2,6.4 53.2,3.5 45.1,3.5 45.1,-1.9 39.8,-7.2 -4.6,-7.2 -9,-2.8 -9,-1.86 -3.65,3.48 -1,39 0,40 70,40 70,19.09 64.6,19.09 64.6,3.5 64.6,3.5 61.6,3.5 61.6,6.4 61.6,6.4
GND on Inner2: 53.2,6.42 53.2,3.5 45.12,3.5 45.1,3.52 45.1,-4.08 43.4,-5.78 -0.6,-5.78 -3.3,-3.08 -3.3,-1.38 -3.1,-1.18 -3.1,36.82 0.1,40.02 70,40.02 70,19.11 64.61,19.11 64.6,19.12 64.6,3.52 61.6,3.52 61.6,6.42
VCC5V on Top Layer: 64.5,20.6 67.1,20.6 67.1,19.42 64.5,19.42
VCC5V on Top Layer: 53.9,22.9 57.92,22.9 57.92,21.3 53.9,21.3
BAT on Top Layer: 61.4,20.7 63.7,20.7 63.7,19.5 61.4,19.5
BAT on Top Layer: 59.1,21.25 60.3,21.25 60.3,19.6 59.1,19.6
VUSB on Top Layer: 53.3,21.3 54.9,21.3 54.9,19.7 53.3,19.7
$1N23414 on Top Layer: 54.42,4.4 56.28,4.4 56.28,3.84 54.42,3.84

Small or netless copper shapes (teardrops, artwork), in the pictures only: 307 on Top Layer, 112 on Bottom Layer, 5 on Inner2

## Text on the board
Bottom Silkscreen Layer: GND | MOD | RSSI | KEY_B | KEY_A | DIO | CLK | HF ANT
Top Silkscreen Layer: 1 | 2 | 3 | 4 | 5 | 6 | 7 | 8 | DIO | CLK | GND | KEY_B | KEY_A | BAT 302030 | HSR Special Pass Lite V1.1 2023.08 @libc0607 | BAT+ | BAT- | LF  345uH Φ20mm
